# Altium schematic sheet schematic_C.SchDoc: USB Connector and Headers for SD card and Display
size A4; SheetNumber: 3; SheetTotal: 3
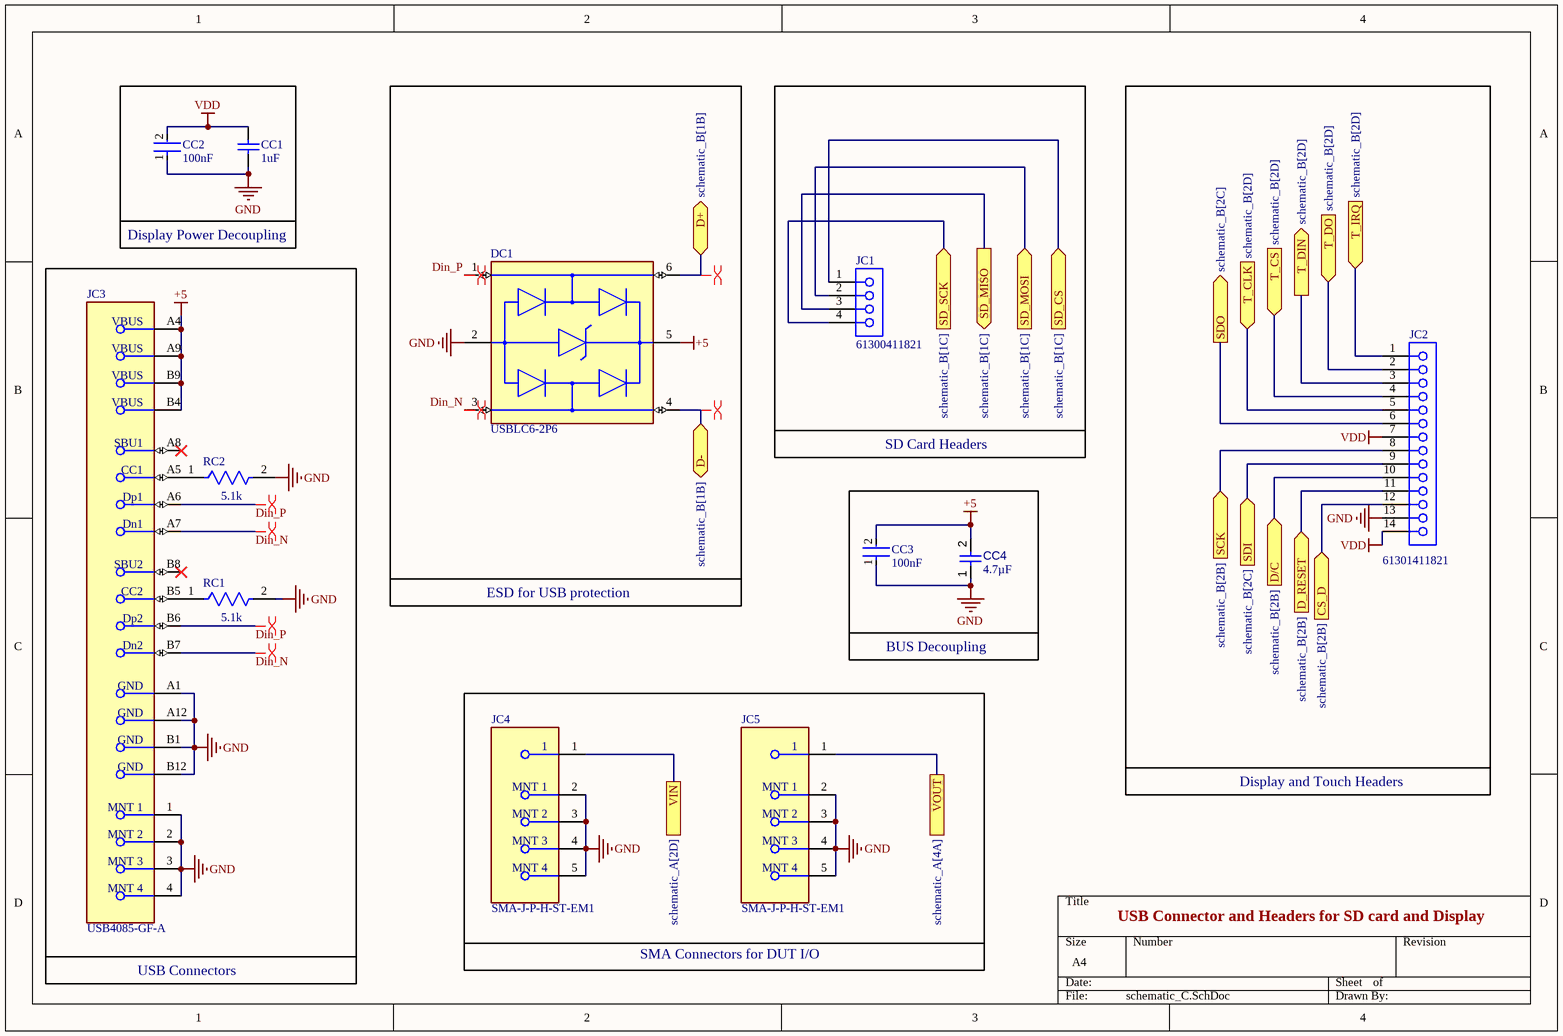
[diagram p0: schematic_C.SchDoc]

## Parts
CC1  1uF  [CAPC0603X33X15NL03T05]
CC2  100nF  [FP-0402-L_1_0_0_05-W_0_5-MFG]
CC3  100nF  [FP-0402-L_1_0_0_05-W_0_5-MFG]
CC4  value 4.7µF  [CAPC0805(2012)145_L]  (hidden comment: Capacitor 4.7µF +/-40% 25V 0805)
DC1  USBLC6-2P6  [FP-SOT-666-MFG]
JC1  61300411821  [61300411821]
JC2  61301411821  [61301411821]
JC3  USB4085-GF-A  [FP-USB4085-GF-A-MFG]
JC4  SMA-J-P-H-ST-EM1  [FP-SMA-J-P-H-ST-EM1-MFG]
JC5  SMA-J-P-H-ST-EM1  [FP-SMA-J-P-H-ST-EM1-MFG]
RC1  5.1k  [KOA_Speer_RN73R1J_MFG]
RC2  5.1k  [KOA_Speer_RN73R1J_MFG]

## Ports
CS_D (in, see schematic_B[2B]), D+ (bidir, see schematic_B[1B]), D- (bidir, see schematic_B[1B]), D/C (in, see schematic_B[2B]), D_RESET (in, see schematic_B[2B]), SCK (in, see schematic_B[2B]), SD_CS (in, see schematic_B[1C]), SD_MISO (out, see schematic_B[1C]), SD_MOSI (in, see schematic_B[1C]), SD_SCK (in, see schematic_B[1C]), SDI (in, see schematic_B[2C]), SDO (out, see schematic_B[2C]), T_CLK (in, see schematic_B[2D]), T_CS (in, see schematic_B[2D]), T_DIN (out, see schematic_B[2D]), T_DO (in, see schematic_B[2D]), T_IRQ (in, see schematic_B[2D]), VIN (see schematic_A[2D]), VOUT (see schematic_A[4A])

## Nets
+5: CC3.2 CC4.2 DC1.5(VBUS) JC3.A4(VBUS) JC3.A9(VBUS) JC3.B4(VBUS) JC3.B9(VBUS)
GND: CC1.2 CC2.1 CC3.1 CC4.1 DC1.2(GND) JC2.13 JC3.1(MNT_1) JC3.2(MNT_2) JC3.3(MNT_3) JC3.4(MNT_4) JC3.A1(GND) JC3.A12(GND) JC3.B1(GND) JC3.B12(GND) JC4.2(MNT_1) JC4.3(MNT_2) JC4.4(MNT_3) JC4.5(MNT_4) JC5.2(MNT_1) JC5.3(MNT_2) JC5.4(MNT_3) JC5.5(MNT_4) RC1.2 RC2.2
VDD: CC1.1 CC2.2 JC2.7 JC2.14
CS_D: JC2.12 ; port CS_D
D+: DC1.6(I/O1) ; port D+
D-: DC1.4(I/O2) ; port D-
D/C: JC2.10 ; port D/C
D_RESET: JC2.11 ; port D_RESET
Din_N: DC1.3(I/O2) JC3.A7(Dn1) JC3.B7(Dn2)
Din_P: DC1.1(I/O1) JC3.A6(Dp1) JC3.B6(Dp2)
SCK: JC2.8 ; port SCK
SD_CS: JC1.1 ; port SD_CS
SD_MISO: JC1.3 ; port SD_MISO
SD_MOSI: JC1.2 ; port SD_MOSI
SD_SCK: JC1.4 ; port SD_SCK
SDI: JC2.9 ; port SDI
SDO: JC2.6 ; port SDO
T_CLK: JC2.5 ; port T_CLK
T_CS: JC2.4 ; port T_CS
T_DIN: JC2.3 ; port T_DIN
T_DO: JC2.2 ; port T_DO
T_IRQ: JC2.1 ; port T_IRQ
VIN: JC4.1 ; port VIN
VOUT: JC5.1 ; port VOUT
NetJC3_A5: JC3.A5(CC1) RC2.1
NetJC3_B5: JC3.B5(CC2) RC1.1

Not connected (* = marked no-connect by the designer): JC3 A8(SBU1)* B8(SBU2)*

## Layout directives
differential pair: D+, D-, Din_N, Din_P

## Notes on the sheet
- Display Power Decoupling
- SD Card Headers
- ESD for USB protection
- BUS Decoupling
- Display and Touch Headers
- USB Connectors
- SMA Connectors for DUT I/O

## Library data of the parts
CC1 = CMP-2010-00160-1: Part Number: 02016D105KAT2A; Manufacturer: AVX Interconnect / Elco
CC2 CC3 = CMP-14477-003271-3: Ceramic Capacitor General Use 0.1uF ±10% 25V X5R 0402; NexarPartId: 49252556; Max Thickness: 550µm; Min Operating Temperature: -55°C; Material: Ceramic; Capacitance: 100nF; Min Length: 950µm; Packaging: Tape & Reel (TR); Min Width: 450µm; Thickness: 558.8µm; Tolerance: 10%; Length: 990.6µm; Case/Package: 0402; Mount: Surface Mount; Height: 550µm; Max Length: 1.05mm; Halogen Free: Halogen Free; Voltage Rating: 25V; Max Operating Temperature: 85°C; Max Width: 550µm; Min Thickness: 450µm; RoHS: Compliant; Width: 508µm; Voltage Rating (DC): 25V
CC4 = CMP-001-00080-4: Chip Capacitor, 4.7µF +/-40%, 25V, 0805, Thickness 1.45 mm; Tolerance: 20%; Voltage Rating: 25V; Min Operating Temperature: -55°C; Max Operating Temperature: 85°C; Pins: 2; Mounting Technology: SMT; Case/Package: 0805
DC1 = CMP-12225-000058-1: TVS DIODE 5.25V 17V SOT666; Min Breakdown Voltage: 6V; Power Line Protection: Yes; Element Configuration: Dual; Test Current: 1mA; Working Voltage: 5V; Number of Channels: 2; Max Reverse Leakage Current: 150nA; Direction: Unidirectional; Peak Pulse Current: 5A; Number of Elements: 1; Capacitance: 3.5pF; Max Breakdown Voltage: 6V; Height: 0.6mm; Depth: 1.3mm; Contact Plating: Tin; Reverse Breakdown Voltage: 6V; REACH SVHC: No SVHC; Operating Supply Voltage: 5V; Width: 1.3mm; Max Operating Temperature: 125°C; Reverse Standoff Voltage: 5V; ESD Protection: Yes; Package Quantity: 1; Termination: SMD/SMT; Length: 1.7mm; Leakage Current: 150nA; Number of Bidirectional Channels: 2; Case/Package: SOT-666; Min Operating Temperature: -40°C; Number of Pins: 6; Clamping Voltage: 17V; Breakdown Voltage: 6V; Lead Free: Lead Free; Radiation Hardening: No; Packaging: Tape and Reel; Mount: Surface Mount; Polarity: Unidirectional
JC1 = CMP-1502-01316-4: THT Vertical Socket Header WR-PHD, Pitch 2.54 mm, Single Row, 4 pins; Current Rating: 3A; Gender: Female; Contact Resistance: 20mΩ; Operating Supply Voltage: 250V; Number of Pins: 4; Lead Pitch: 2.54mm; Orientation: Vertical
JC2 = CMP-1502-01341-4: Btb Conn, Rcpt, 14Pos, 1Row, 2.54Mm Rohs Compliant: Yes; Gender: Female; Operating Supply Voltage: 250V; Current Rating: 3A; Contact Resistance: 20mΩ; Lead Pitch: 2.54mm; Number of Pins: 14; RoHS: Non-Compliant; Orientation: Vertical
JC3 = CMP-196119-000001-2: CONN RCPT USB2.0 TYPE C 24POS RA; Gender: Receptacle; Number of Positions: 16; USB Standard: USB 2.0; Orientation: Right Angle; Contact Plating: Gold; Contact Material: Copper Alloy
JC4 JC5 = CMP-02754-000006-1: CONN SMA JACK STR 50OHM EDGE MNT; Dielectric Material: PTFE; Center Contact Plating: Gold; Max Frequency: 6GHz; Body Material: Brass; Voltage Rating: 335V; Impedance: 50R; Package Quantity: 1; Case/Package: SMA; Max Operating Temperature: 125°C; Fastening Type: Threaded; Orientation: Straight; Depth: 13.33mm; RoHS Compliant: Yes; Length: 6.35mm; Insulation Material: Polytetrafluoroethylene; Termination: Solder; Min Operating Temperature: -65°C; Housing Color: Gold; Contact Plating: Gold; Contact Material: Copper; Connector Type: SMA; Mount: Edge; Series: SMA; Packaging: Tray; Body Plating: Gold; Radiation Hardening: No
RC1 RC2 = CMP-00683-99548008-1: RN73R1JTTD5101B25 Res, 5K1, 0.1%, 0.1W, 0603 Rohs Compliant: Yes; Power Rating: 100mW; Resistance: 5.1kΩ; Temperature Coefficient: 25ppm/°C; Voltage Rating: 75V; Min Operating Temperature: -55°C; Case/Package: 0603; Height: 550µm; Composition: Thin Film; Max Operating Temperature: 155°C; NexarPartId: 99548008; Tolerance: 0.1%; Ambient Temperature Range High: 85°C